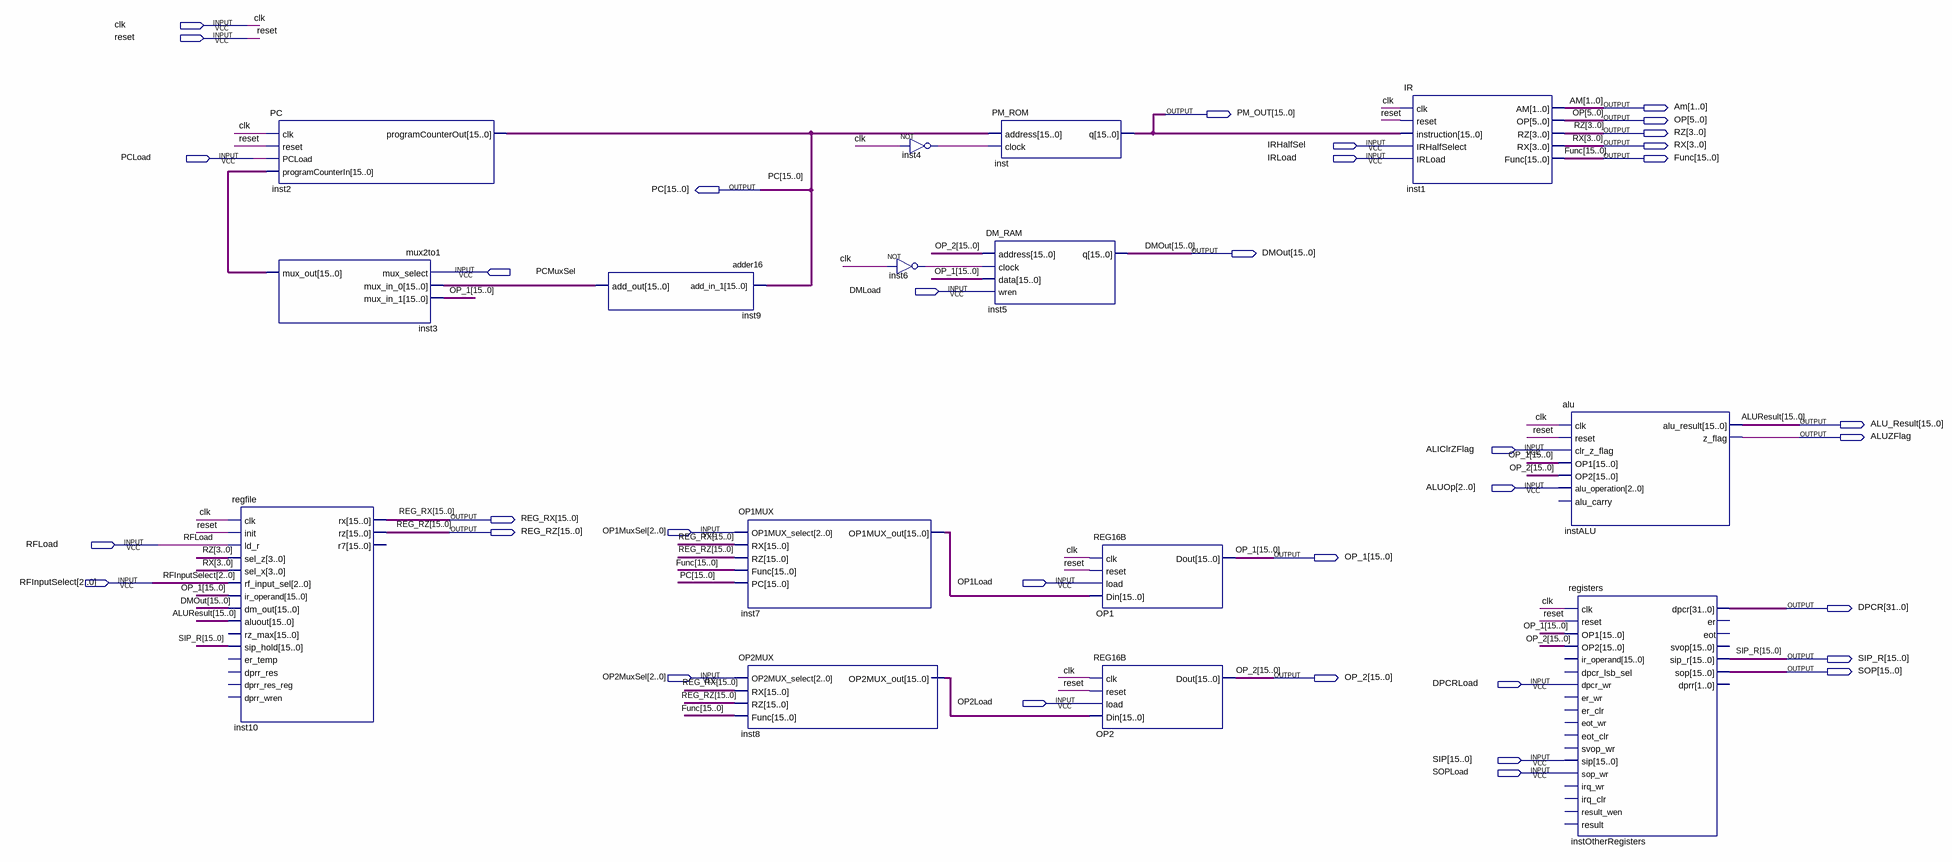
[diagram p0: schematic sheet]
// Quartus schematic Datapath.bdf as structural Verilog: 15 symbols, 35 pins
module Datapath (
  input  clk,
  input  reset,
  input  IRHalfSel,
  input  PCLoad,
  input  IRLoad,
  input  PCMuxSel,
  input  DMLoad,
  input  ALIClrZFlag,
  input  [2:0] ALUOp,
  input  [2:0] OP1MuxSel,
  input  RFLoad,
  input  [2:0] RFInputSelect,
  input  OP1Load,
  input  [2:0] OP2MuxSel,
  input  DPCRLoad,
  input  OP2Load,
  input  [15:0] SIP,
  input  SOPLoad,
  output [1:0] Am,
  output [15:0] PM_OUT,
  output [5:0] OP,
  output [3:0] RZ,
  output [3:0] RX,
  output [15:0] Func,
  output [15:0] PC,
  output [15:0] DMOut,
  output [15:0] ALU_Result,
  output ALUZFlag,
  output [15:0] REG_RX,
  output [15:0] REG_RZ,
  output [15:0] OP_1,
  output [31:0] DPCR,
  output [15:0] SIP_R,
  output [15:0] SOP,
  output [15:0] OP_2
);

  wire inst4_out, inst6_out;
  wire [15:0] inst3_mux_out, inst9_add_out, OP1MuxOut, OP2MuxOut;

  regfile inst10 (
    .clk(clk), .init(reset), .ld_r(RFLoad), .sel_z(RZ), .sel_x(RX), .rf_input_sel(RFInputSelect),
    .ir_operand(OP_1), .dm_out(DMOut), .aluout(ALU_Result), .sip_hold(SIP_R), .rx(REG_RX), .rz(REG_RZ));  // open: rz_max, er_temp, dprr_res, dprr_res_reg, dprr_wren, r7
  PC inst2 (.clk(clk), .reset(reset), .PCLoad(PCLoad), .programCounterIn(inst3_mux_out), .programCounterOut(PC));
  mux2to1 inst3 (.mux_select(PCMuxSel), .mux_in_0(inst9_add_out), .mux_in_1(OP_1), .mux_out(inst3_mux_out));
  adder16 inst9 (.add_in_1(PC), .add_out(inst9_add_out));
  OP1MUX inst7 (.OP1MUX_select(OP1MuxSel), .RX(REG_RX), .RZ(REG_RZ), .Func(Func), .PC(PC), .OP1MUX_out(OP1MuxOut));
  OP2MUX inst8 (.OP2MUX_select(OP2MuxSel), .RX(REG_RX), .RZ(REG_RZ), .Func(Func), .OP2MUX_out(OP2MuxOut));
  not inst6 (inst6_out, clk);
  not inst4 (inst4_out, clk);
  PM_ROM inst (.address(PC), .clock(inst4_out), .q(PM_OUT));
  DM_RAM inst5 (.address(OP_2), .clock(inst6_out), .data(OP_1), .wren(DMLoad), .q(DMOut));
  REG16B OP1 (.clk(clk), .reset(reset), .load(OP1Load), .Din(OP1MuxOut), .Dout(OP_1));
  REG16B OP2 (.clk(clk), .reset(reset), .load(OP2Load), .Din(OP2MuxOut), .Dout(OP_2));
  IR inst1 (
    .clk(clk), .reset(reset), .instruction(PM_OUT), .IRHalfSelect(IRHalfSel), .IRLoad(IRLoad), .AM(Am),
    .OP(OP), .RZ(RZ), .RX(RX), .Func(Func));
  alu instALU (
    .clk(clk), .reset(reset), .clr_z_flag(ALIClrZFlag), .OP1(OP_1), .OP2(OP_2), .alu_operation(ALUOp),
    .alu_result(ALU_Result), .z_flag(ALUZFlag));  // open: alu_carry
  registers instOtherRegisters (
    .clk(clk), .reset(reset), .OP1(OP_1), .OP2(OP_2), .dpcr_wr(DPCRLoad), .sip(SIP), .sop_wr(SOPLoad),
    .dpcr(DPCR), .sip_r(SIP_R), .sop(SOP));  // open: ir_operand, dpcr_lsb_sel, er_wr, er_clr, eot_wr, eot_clr, svop_wr, irq_wr, irq_clr, result_wen, result, er, eot, svop, dprr

  // Other names for the same wires on the sheet: ALUResult[15:0] = ALU_Result
endmodule
